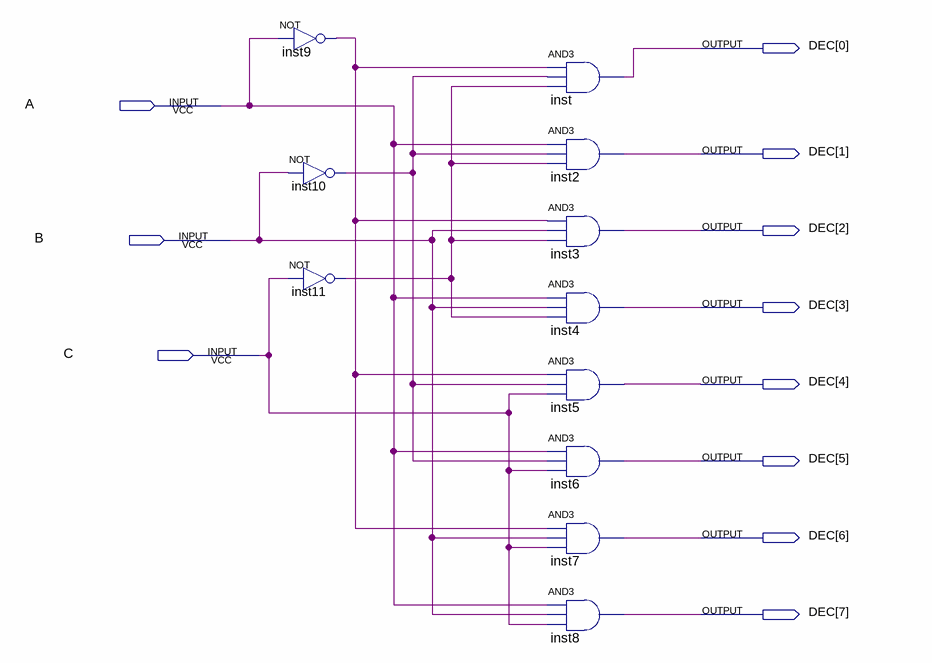
[diagram p0: schematic sheet]
// Quartus schematic Decoder_3x8.bdf as structural Verilog: 11 symbols, 11 pins
module Decoder_3x8 (
  input  A,
  input  B,
  input  C,
  output [7:0] DEC
);

  wire inst9_out, inst10_out, inst11_out;

  not inst9 (inst9_out, A);
  not inst10 (inst10_out, B);
  not inst11 (inst11_out, C);
  and inst (DEC[0], inst9_out, inst10_out, inst11_out);
  and inst2 (DEC[1], A, inst10_out, inst11_out);
  and inst3 (DEC[2], inst9_out, B, inst11_out);
  and inst4 (DEC[3], A, B, inst11_out);
  and inst5 (DEC[4], inst9_out, inst10_out, C);
  and inst6 (DEC[5], A, inst10_out, C);
  and inst7 (DEC[6], inst9_out, B, C);
  and inst8 (DEC[7], A, B, C);
endmodule
